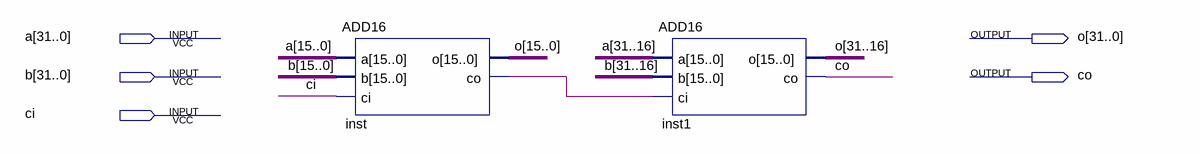
[diagram p0: schematic sheet]
// Quartus schematic ADD32.bdf as structural Verilog: 2 symbols, 5 pins
module ADD32 (
  input  [31:0] a,
  input  [31:0] b,
  input  ci,
  output [31:0] o,
  output co
);

  wire inst_co;

  ADD16 inst (.a(a[15:0]), .b(b[15:0]), .ci(ci), .o(o[15:0]), .co(inst_co));
  ADD16 inst1 (.a(a[31:16]), .b(b[31:16]), .ci(inst_co), .o(o[31:16]), .co(co));
endmodule
